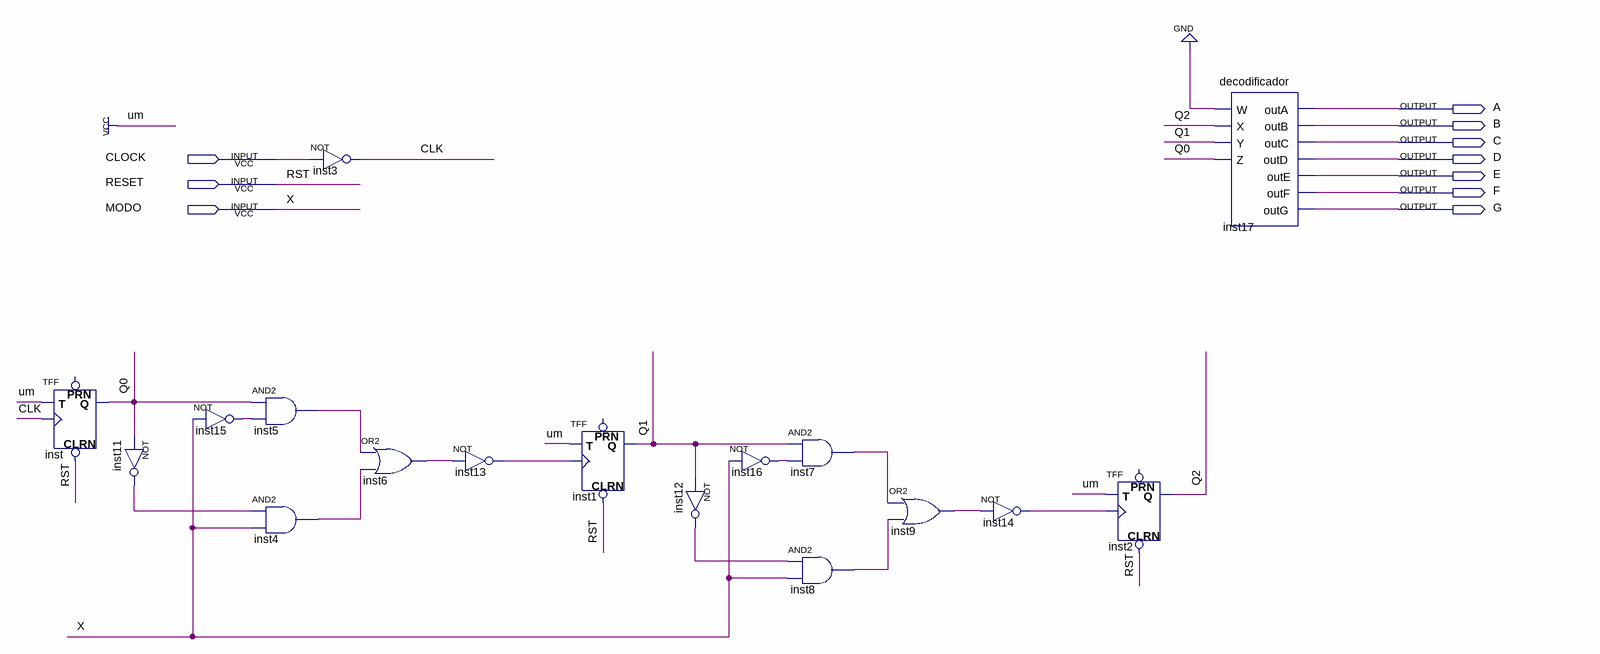
[diagram p0: schematic sheet]
// Quartus schematic contCD.bdf as structural Verilog: 17 symbols, 10 pins
module contCD (
  input  CLOCK,
  input  RESET,
  input  MODO,
  output A,
  output B,
  output C,
  output D,
  output E,
  output F,
  output G
);

  wire CLK, inst4_out, inst5_out, inst6_out, inst7_out, inst8_out, inst9_out, inst11_out, inst12_out,
       inst13_out, inst14_out, inst15_out, inst16_out, Q0, Q1, Q2;

  TFF inst (.CLRN(RESET), .T(1'b1), .CLK(CLK), .Q(Q0));  // open: PRN
  not inst11 (inst11_out, Q0);
  and inst5 (inst5_out, Q0, inst15_out);
  not inst15 (inst15_out, MODO);
  and inst4 (inst4_out, inst11_out, MODO);
  not inst3 (CLK, CLOCK);
  or inst6 (inst6_out, inst5_out, inst4_out);
  not inst13 (inst13_out, inst6_out);
  TFF inst1 (.CLRN(RESET), .T(1'b1), .CLK(inst13_out), .Q(Q1));  // open: PRN
  not inst12 (inst12_out, Q1);
  and inst7 (inst7_out, Q1, inst16_out);
  not inst16 (inst16_out, MODO);
  and inst8 (inst8_out, inst12_out, MODO);
  or inst9 (inst9_out, inst7_out, inst8_out);
  not inst14 (inst14_out, inst9_out);
  TFF inst2 (.CLRN(RESET), .T(1'b1), .CLK(inst14_out), .Q(Q2));  // open: PRN
  decodificador inst17 (
    .W(1'b0), .X(Q2), .Y(Q1), .Z(Q0), .outA(A), .outB(B), .outC(C), .outD(D), .outE(E), .outF(F), .outG(G));

  // Other names for the same wires on the sheet: RST = RESET; X = MODO
endmodule
